# EasyEDA Pro project 01_立创eda专业版_esp32语音助手-自制版_2024-07-09.epro, schematic Schematic1

## Sheets
1 esp32_mini: Create Date: 2024-06-12; Page Name: esp32_mini; Project Name: esp32语音助手-自制版; Schematic Name: Schematic1; Update Date: 2024-06-21; Company: 嘉立创EDA; Page Size: A4; Version: V1.0
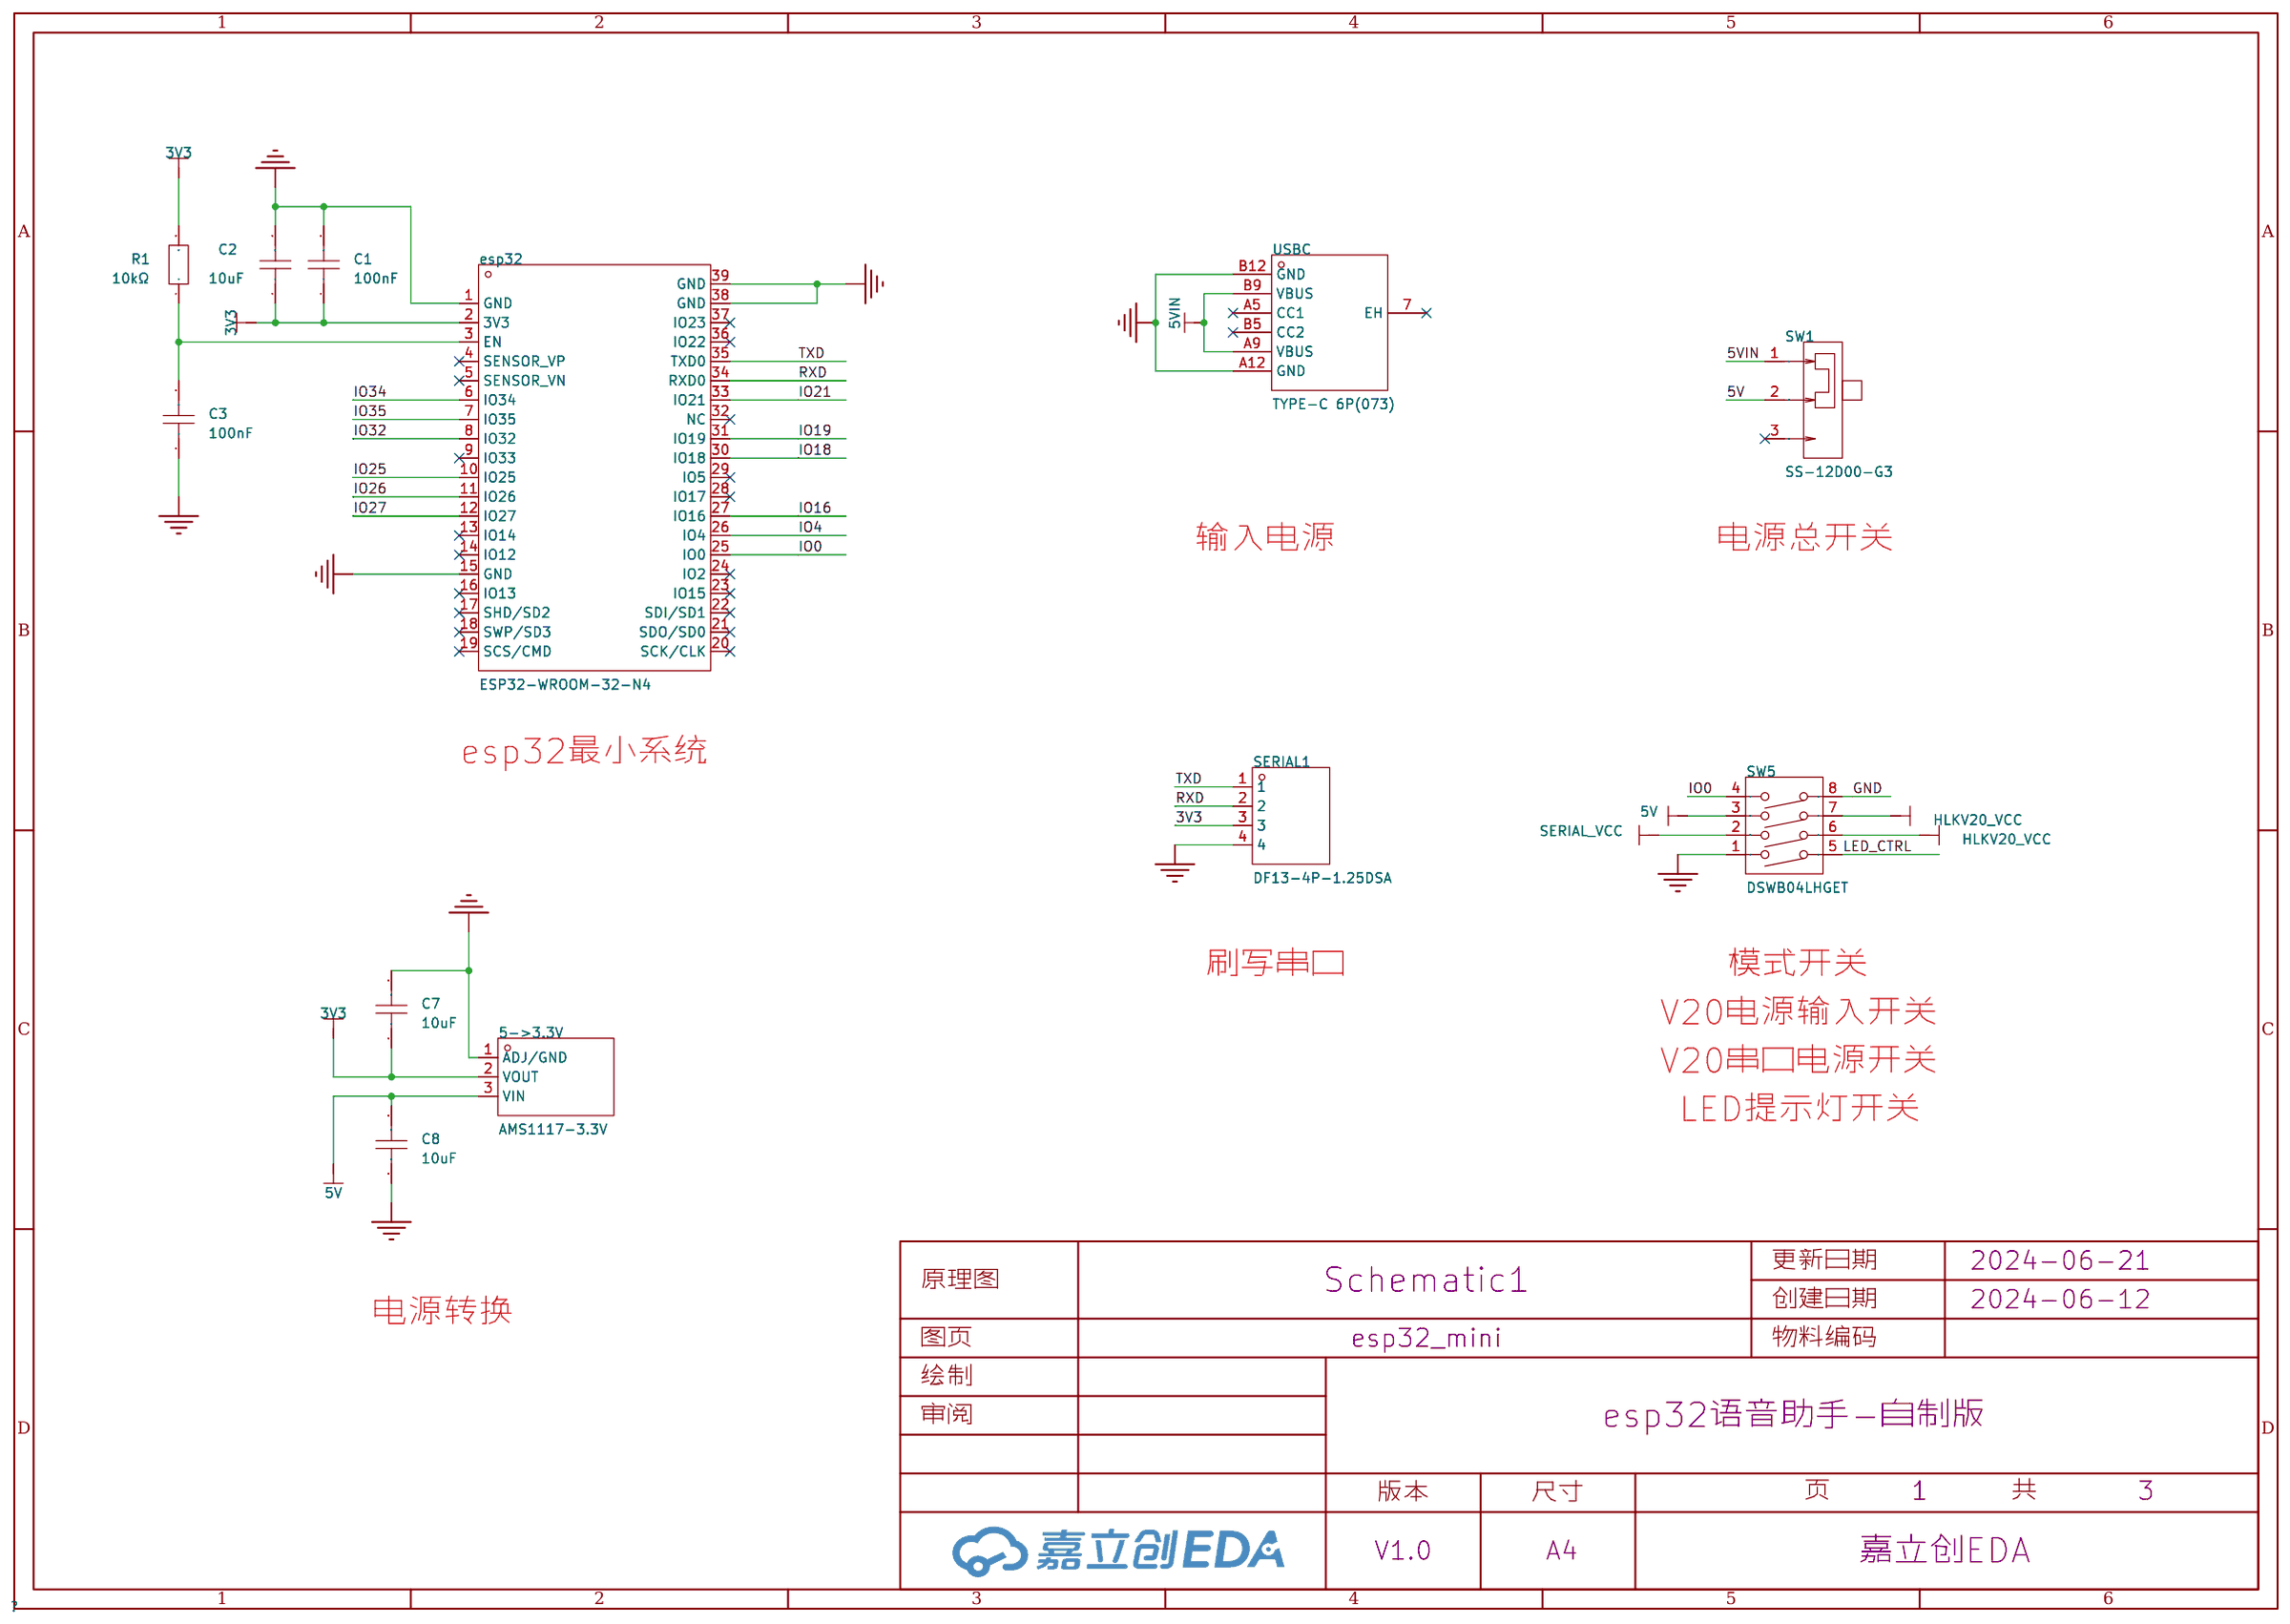
[diagram p0: esp32_mini]
2 hlkv20: Page Name: hlkv20; Update Date: 2024-06-16
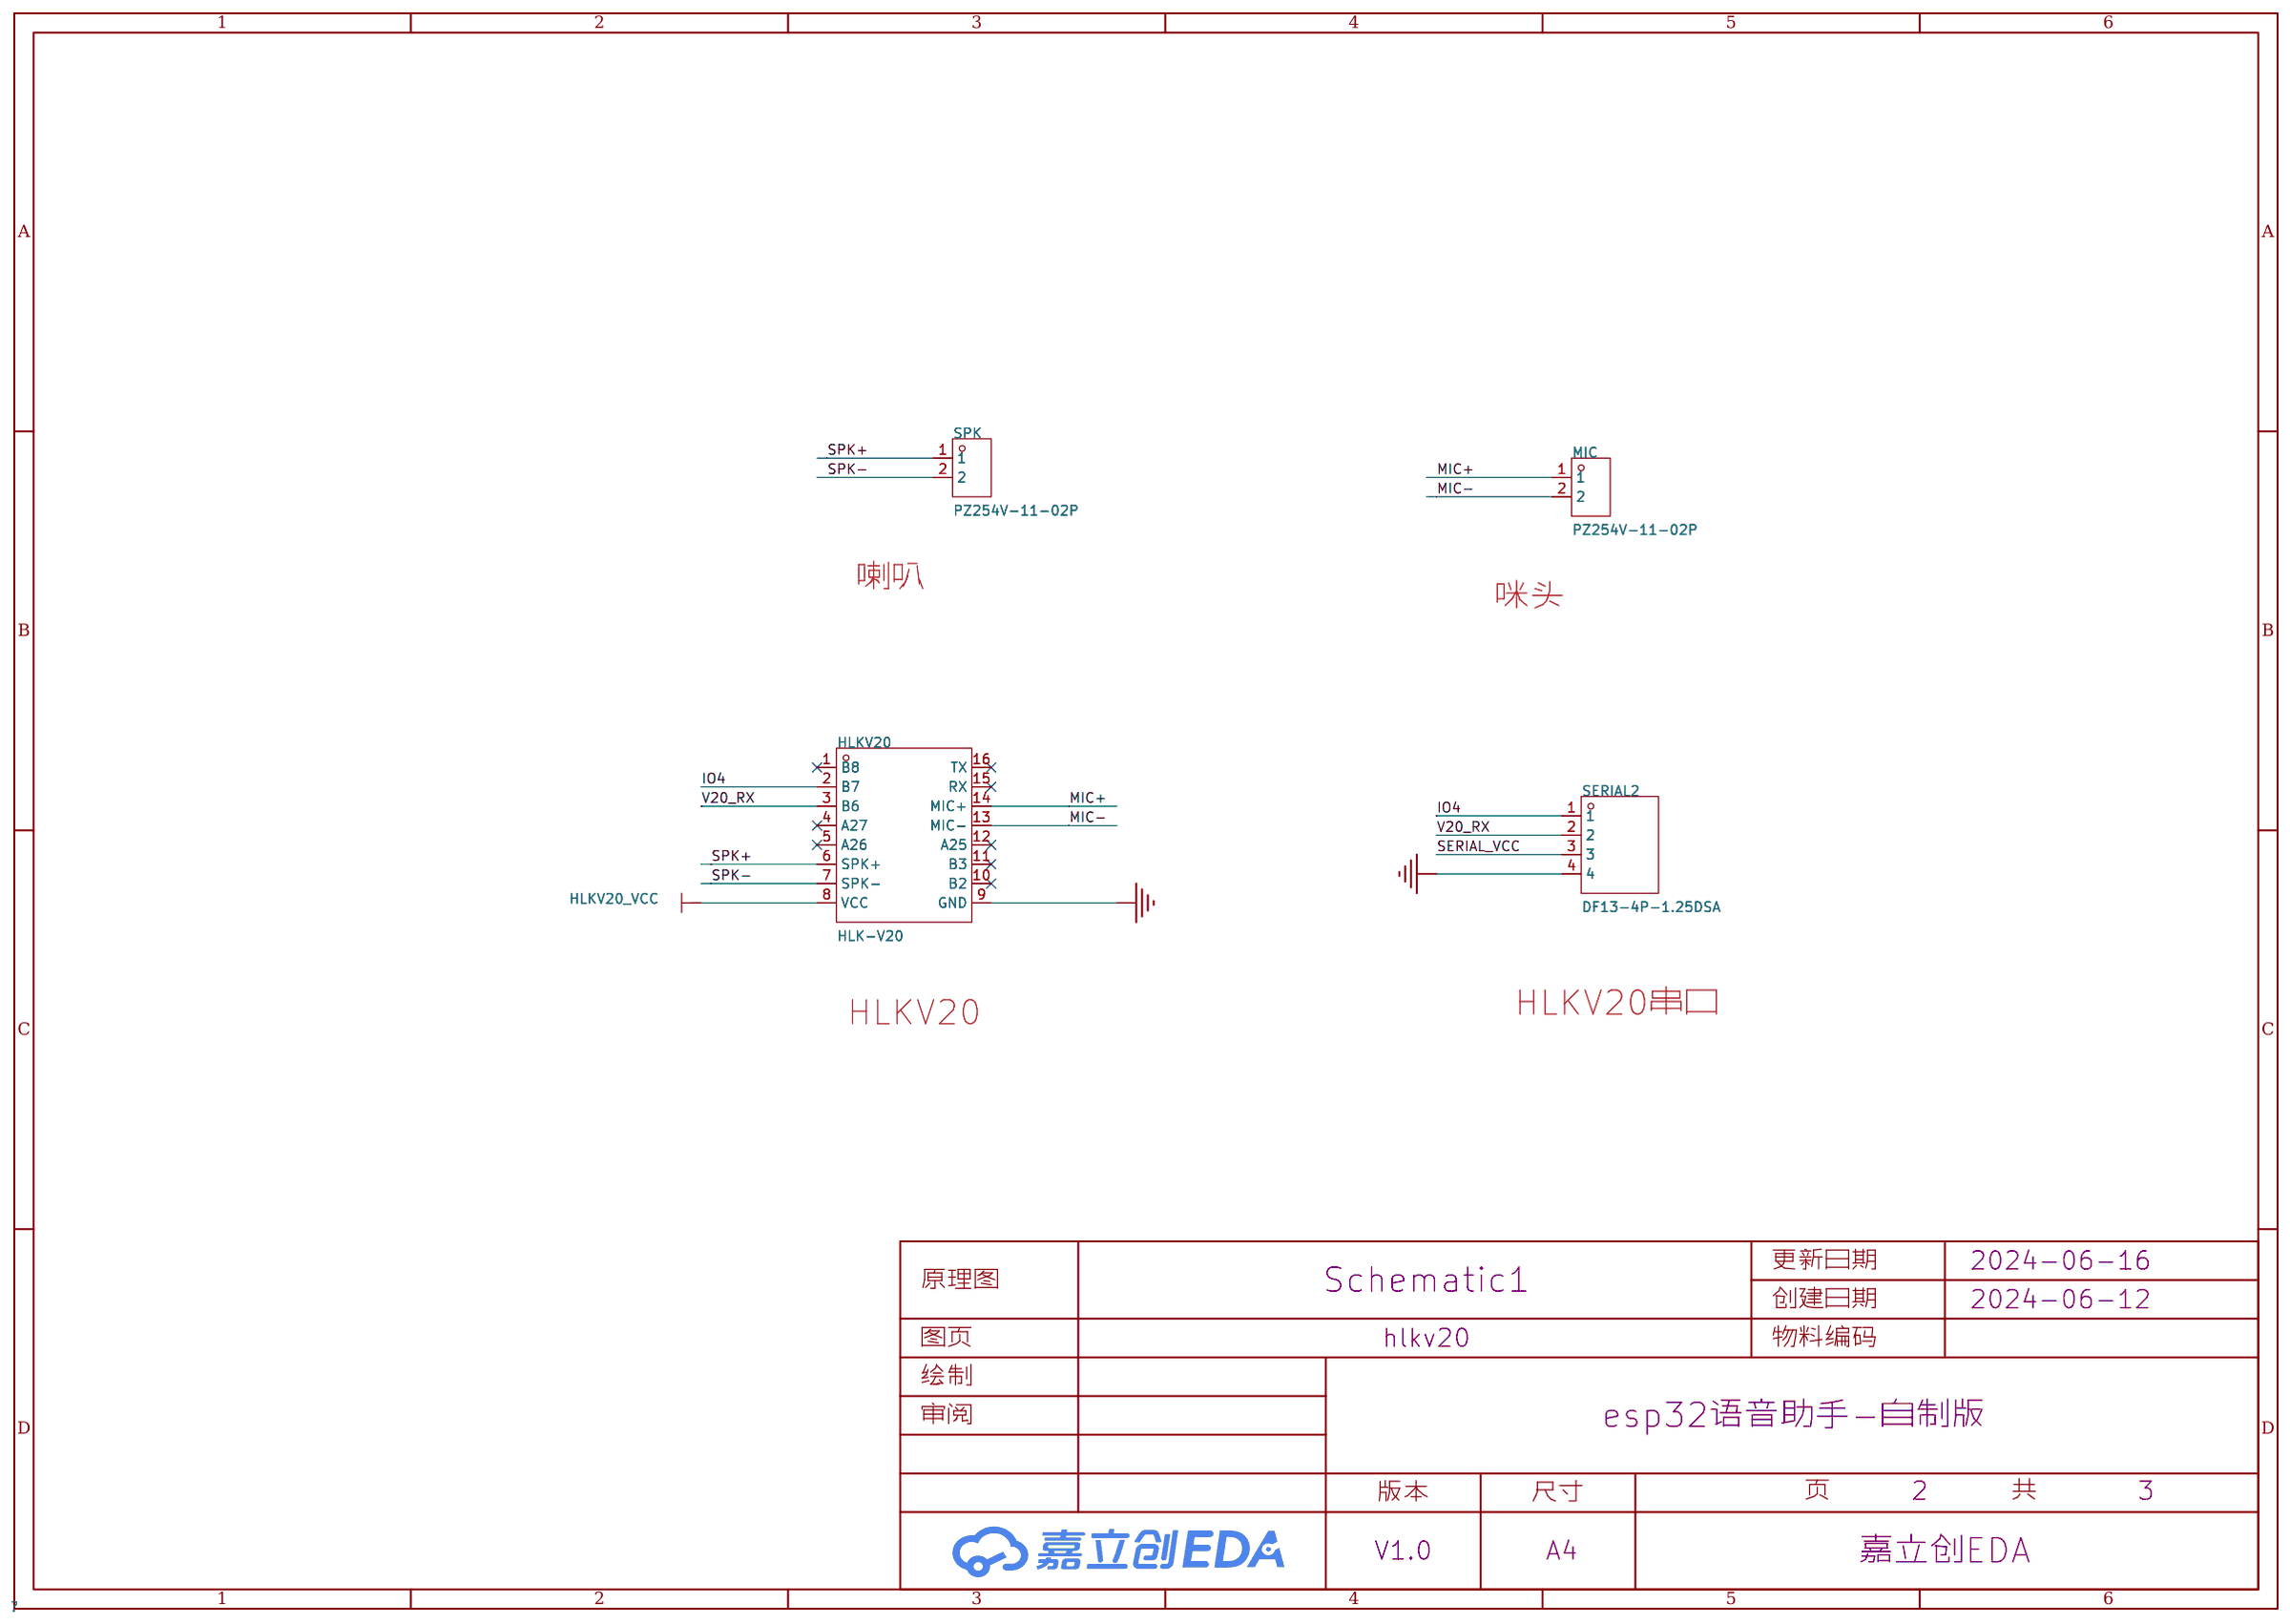
[diagram p1: hlkv20]
3 inandout: Page Name: inandout; Update Date: 2024-06-13
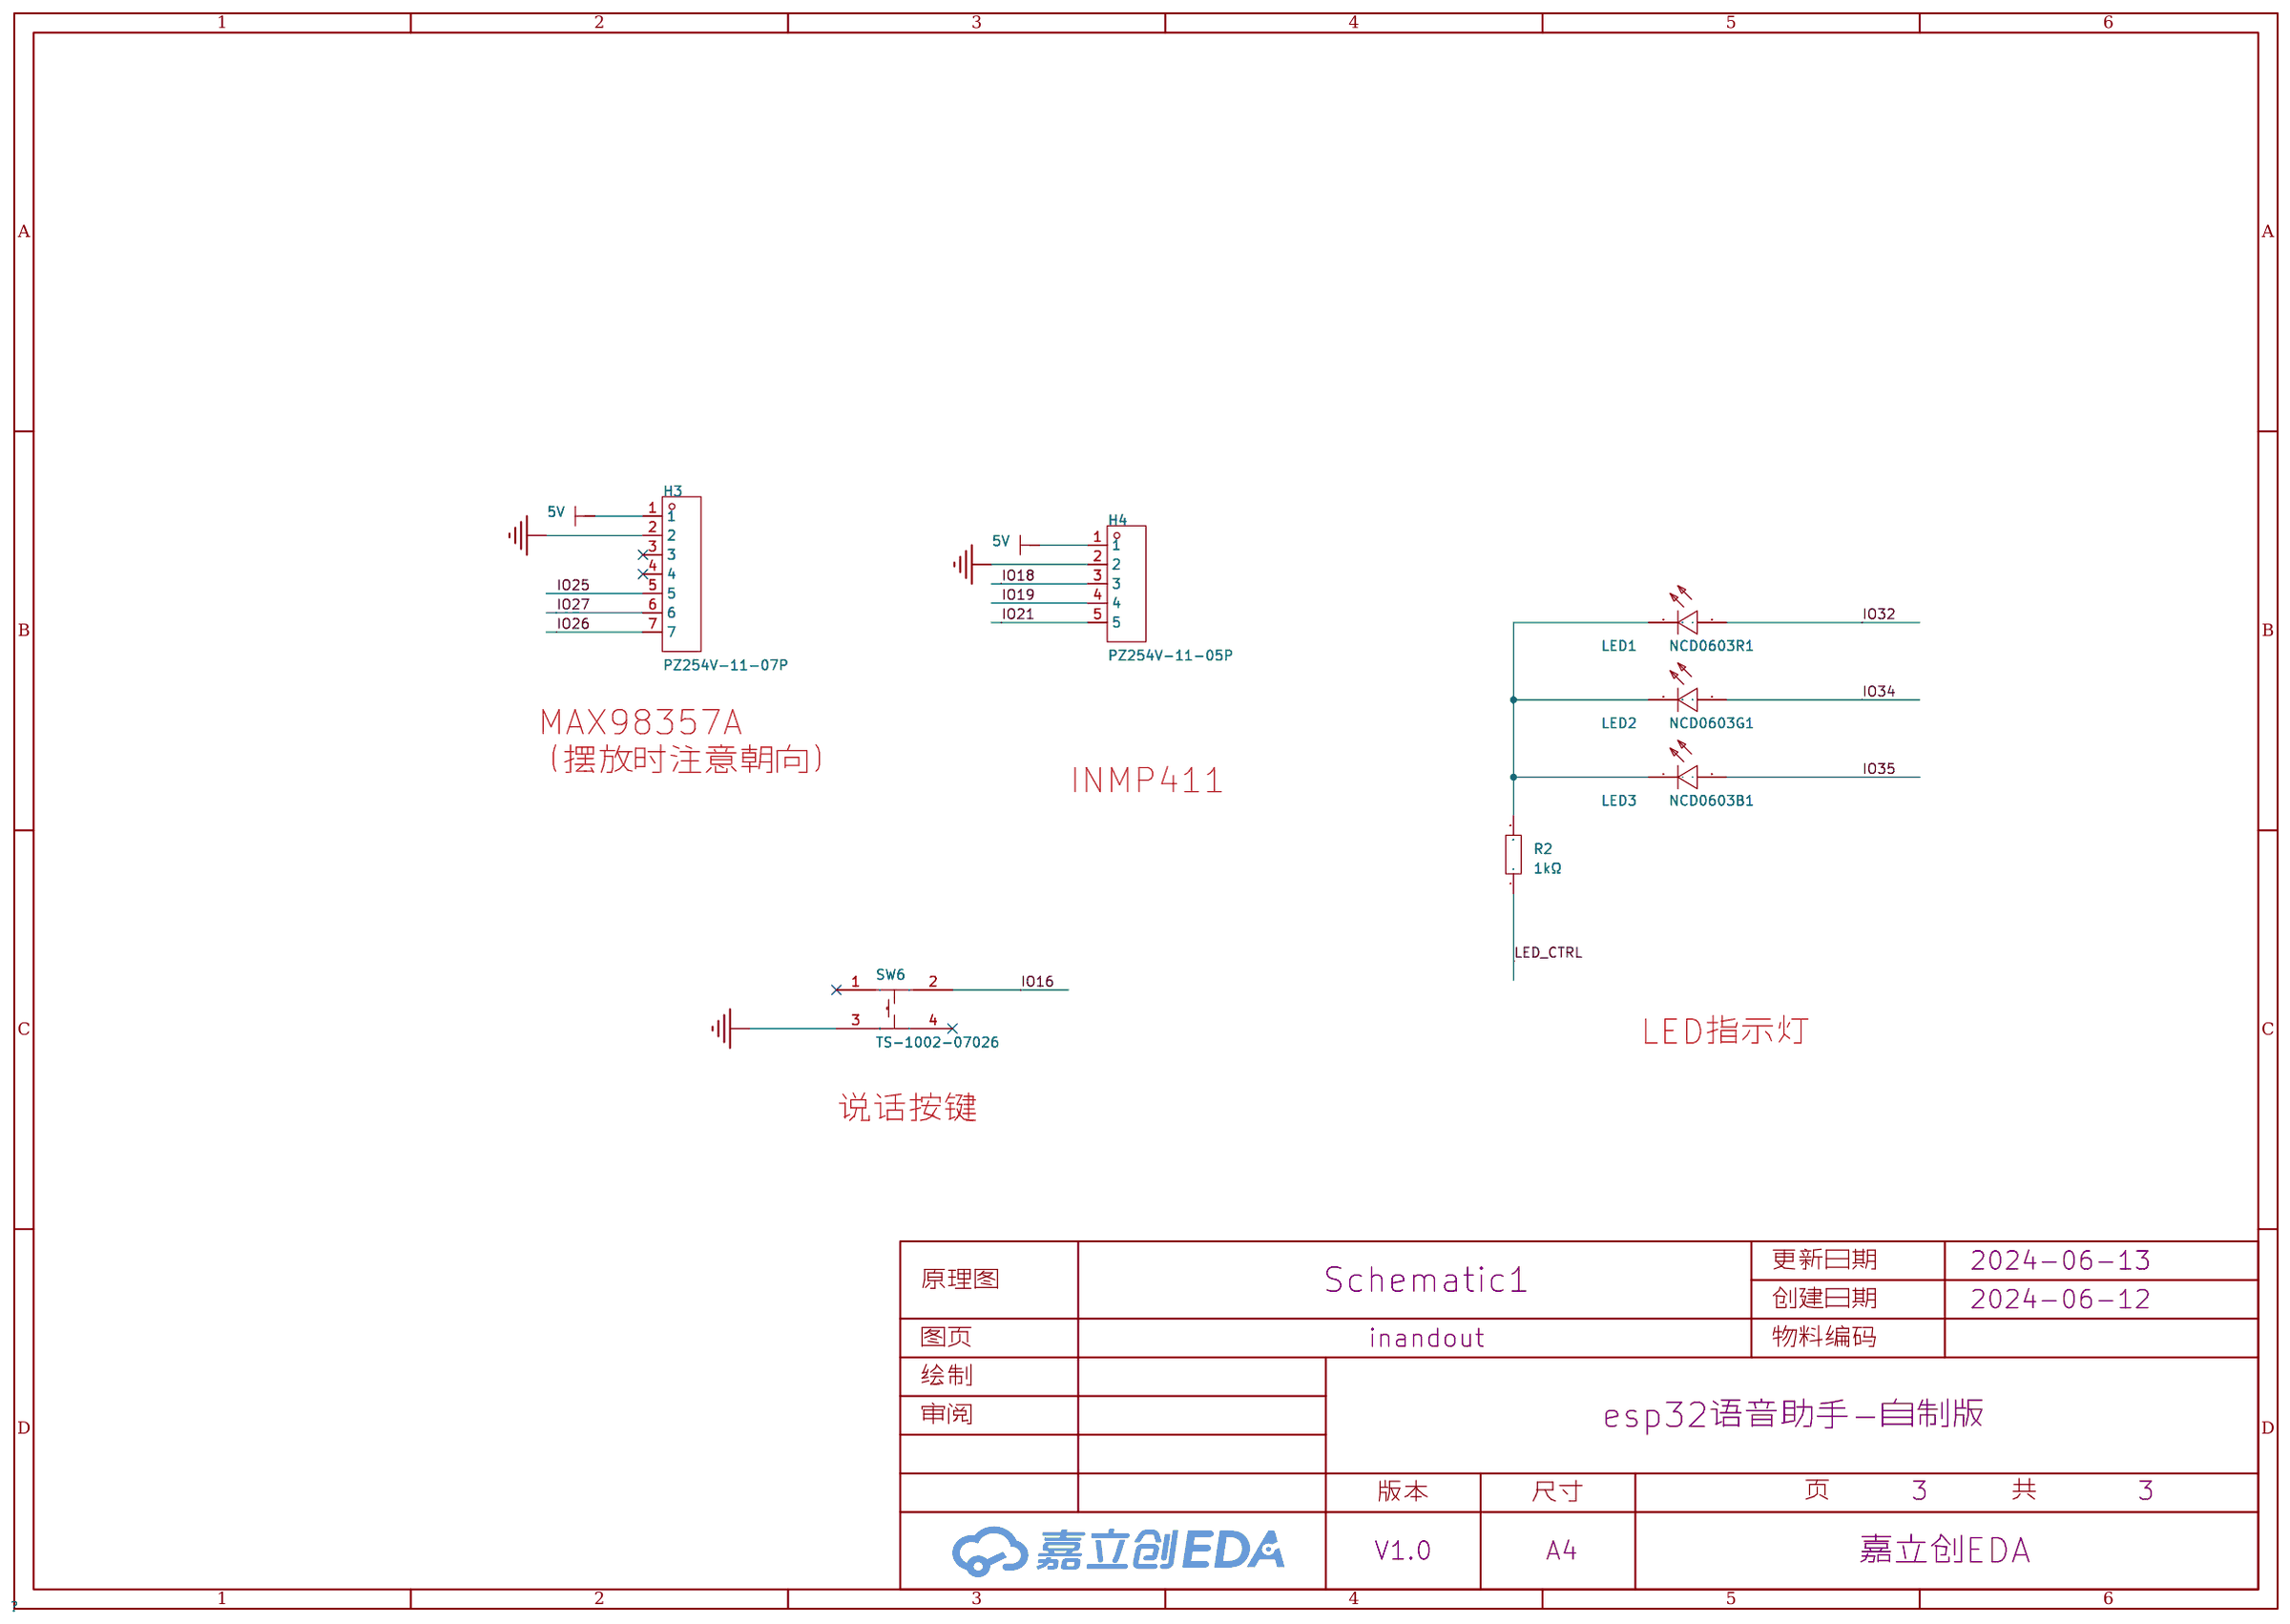
[diagram p2: inandout]

## Parts
sheet esp32_mini
5->3.3V  AMS1117-3.3V  [SOT-89-3_L4.5-W2.5-P1.50-LS4.2-BR]
C1  100nF  [C0603]
C2  10uF  [C0603]
C3  100nF  [C0603]
C7  10uF  [C0603]
C8  10uF  [C0603]
esp32  ESP32-WROOM-32-N4  [WIFIM-SMD_ESP32-WROOM-32-N4]
R1  10kΩ  [R0603]
SERIAL1  DF13-4P-1.25DSA  [CONN-TH_DF13-4P-1.25DSA]
SW1  SS-12D00-G3  [SW-TH_SS-12D00-G3]
SW5  DSWB04LHGET  [SW-TH_DSWB04LHGET]
USBC  TYPE-C 6P(073)  [TYPE-C-SMD_TYPE-C-6P]
sheet hlkv20
HLKV20  HLK-V20  [SMD-16_L18.0-W16.0-P2.00-HLK-V20]
MIC  PZ254V-11-02P  [HDR-TH_2P-P2.54-V-M]
SERIAL2  DF13-4P-1.25DSA  [CONN-TH_DF13-4P-1.25DSA]
SPK  PZ254V-11-02P  [HDR-TH_2P-P2.54-V-M]
sheet inandout
H3  PZ254V-11-07P  [HDR-TH_7P-P2.54-V-M]
H4  PZ254V-11-05P  [HDR-TH_5P-P2.54-V-M]
LED1  NCD0603R1  [LED0603-RD_RED]
LED2  NCD0603G1  [LED0603-RD]
LED3  NCD0603B1  [LED0603-RD]
R2  1kΩ  [R0603]
SW6  TS-1002-07026  [SW-TH_4P-L6.0-W6.0-P4.50-LS6.5]

## Library data of the parts
5->3.3V = AMS1117-3.3V_C5120796: 输出类型:固定;最大输入电压:18V;输出电压:3.3V;最大输出电流:1A;输出极性:正极;; LCSC Part Name: 输入18V 输出3.3V 1A; Supplier Part: C5120796; Manufacturer: MSKSEMI(美森科); Supplier Footprint: SOT-89; JLCPCB Part Class: 扩展库; Datasheet: https://atta.szlcsc.com/upload/public/pdf/source/20231123/6117526697EB8BF6175FDEEBA0877266.pdf; Supplier: LCSC; Output Type: 固定; Maximum Input Voltage: 18V; Output Voltage: 3.3V; MAX Output Current: 1A; Dropout Voltage: 1.4V@(1A); standby current: 12mA; Operating Temperature: 0℃~+125℃; Output Polarity: 正极; Number of Outputs: 1
C1 C3 = CC0603KRX7R9BB104: 容值:100nF;精度:±10%;额定电压:50V;材质(温度系数):X7R;; LCSC Part Name: 100nF ±10% 50V; Supplier Part: C14663; Manufacturer: YAGEO(国巨); Supplier Footprint: 0603; JLCPCB Part Class: 基础库; Datasheet: https://atta.szlcsc.com/upload/public/pdf/source/20180910/C282072_33301C7F631E79921B82A8DAC6BCC5B3.pdf; Supplier: LCSC; Tolerance: ±10%; Voltage Rated: 50V; Temperature Coefficient: X7R
C2 = CL10A106MA8NRNC: 容值:10uF;精度:±20%;额定电压:25V;材质(温度系数):X5R;; LCSC Part Name: 10uF ±20% 25V; Supplier Part: C96446; Manufacturer: SAMSUNG(三星); Supplier Footprint: 0603; JLCPCB Part Class: 基础库; Datasheet: https://atta.szlcsc.com/upload/public/pdf/source/20160218/1457707763339.pdf; Supplier: LCSC; Tolerance: ±20%; Voltage Rated: 25V; Temperature Coefficient: X5R
C7 C8 = CL10A106KP8NNNC: 容值:10uF;精度:±10%;额定电压:10V;材质(温度系数):X5R;; LCSC Part Name: 10uF ±10% 10V; Supplier Part: C19702; Manufacturer: SAMSUNG(三星); Supplier Footprint: 0603; JLCPCB Part Class: 基础库; Datasheet: https://atta.szlcsc.com/upload/public/pdf/source/20160218/1457707763339.pdf; Supplier: LCSC; Tolerance: ±10%; Voltage Rated: 10V; Temperature Coefficient: X5R
esp32 = ESP32-WROOM-32-N4: WiFi+蓝牙4.2+双核CPU,ESP32; LCSC Part Name: WiFi+蓝牙4.2+双核CPU模块; Supplier Part: C82899; Manufacturer: ESPRESSIF(乐鑫); Supplier Footprint: SMD,18x25.5mm; JLCPCB Part Class: 扩展库; Datasheet: https://atta.szlcsc.com/upload/public/pdf/source/20210719/C82899_2D52724B6FAFABC419BCF308C5944296.pdf; Supplier: LCSC
R1 = FRC0603J103TS: 电阻类型:厚膜电阻;阻值:10kΩ;精度:±5%;功率:100mW;最大工作电压:75V;温度系数:±100ppm/℃;; LCSC Part Name: 10kΩ ±5% 100mW 厚膜电阻; Supplier Part: C2930027; Manufacturer: FOJAN(富捷); Supplier Footprint: 0603; JLCPCB Part Class: 扩展库; Datasheet: https://atta.szlcsc.com/upload/public/pdf/source/20211221/925EC7D7225764EE0046F22065062C87.pdf; Supplier: LCSC; Type: 厚膜电阻; Tolerance: ±5%; Power(Watts): 100mW; Overload Voltage (Max): 75V; Temperature Coefficient: ±100ppm/℃; Operating Temperature Range: -55℃~+155℃
SERIAL1 SERIAL2 = DF13-4P-1.25DSA: 插针结构:1x4P;间距:1.25mm;安装方式:-;参考系列:-;总PIN数:4P;排数:1;每排PIN数:4;行距:-;触头材质:黄铜;; LCSC Part Name: 间距:1.25mm 1x4P; Supplier Part: C202091; Manufacturer: HRS(广濑); Supplier Footprint: P=1.25mm; JLCPCB Part Class: 扩展库; Datasheet: https://atta.szlcsc.com/upload/public/pdf/source/20180509/C202091_DB48A71B72F23293CB2FD82E8A62B156.pdf; Supplier: LCSC; Pins Structure: 1x4P; Pitch: 1.25mm; Number of Pins: 4P; Number of Rows: 1; Number of PINs Per Row: 4; Contact Material: 黄铜
SW1 = SS-12D00-G3: Supplier Part: C22355741; Manufacturer: SOFNG(硕方); Supplier Footprint: 插件-3P,8.8x3.9mm; Datasheet: https://atta.szlcsc.com/upload/public/pdf/source/20240529/1037A069FE9BBCECE56007AB916D4384.pdf; Supplier: LCSC
SW5 = DSWB04LHGET: 类型:平拨,凸起式;电路结构:单刀单掷;开关位数:4位;使用寿命:-;颜色:红色;; LCSC Part Name: 间距2.54mm 平拨,凸起式 4位拨码开关; Supplier Part: C99418; Manufacturer: YE; Supplier Footprint: 插件; JLCPCB Part Class: 扩展库; Datasheet: https://atta.szlcsc.com/upload/public/pdf/source/20220830/02827E67A8727938D957A3CE4C86C92D.pdf; Supplier: LCSC; Type: 平拨,凸起式; Circuit: 单刀单掷; Number of Positions: 4位; Lead Pitch: 2.54mm; Color: 红色
USBC = TYPE-C 6P(073): 连接器类型:Type-C;标准:-;公母:母;端口数量:1;触点数量:6P;安装方式:卧贴;额定电流 - 电源:5A;工作温度范围:-25℃~+85℃;; LCSC Part Name: Type-C 母 卧贴; Supplier Part: C668623; Manufacturer: SHOU HAN(首韩); Supplier Footprint: SMD; JLCPCB Part Class: 扩展库; Datasheet: https://atta.szlcsc.com/upload/public/pdf/source/20200618/C668623_A4B260DED7AC1949BAC6AE39E9F4CD80.pdf; Supplier: LCSC; Connector Type: Type-C; Gender: 母; Number of Ports: 1; Number of Contacts: 6P; Mounting Style: 卧贴; Current Rating - Power (Max): 5A; Operating Temperature Range: -25℃~+85℃
HLKV20 = HLK-V20: Supplier Part: C2831623; Manufacturer: HI-LINK(海凌科); JLCPCB Part Class: 扩展库; Datasheet: https://atta.szlcsc.com/upload/public/pdf/source/20210630/C2831623_FC9FEB51768199029C6D7EE3A64B85DD.pdf; Supplier: LCSC
MIC SPK = PZ254V-11-02P: 插针结构:1x2P;间距:2.54mm;行距:-;圆针/方针:方针;安装类型:直插;排数:单排;总PIN位数:2P;额定电流:-;额定电压:-;配合针长度:6mm;塑高:2.5mm;端接针长度:3mm;触头材质:黄铜;触头镀层:-;工作温度范围:-40℃~+105℃;颜色:黑色;; LCSC Part Name: 间距:2.54mm 1x2P 直插 方针; Supplier Part: C492401; Manufacturer: XFCN(兴飞); Supplier Footprint: 插件,P=2.54mm; JLCPCB Part Class: 扩展库; Datasheet: https://atta.szlcsc.com/upload/public/pdf/source/20200309/C492401_A812433581A9B211A7FFA413ADDFF0E5.pdf; Supplier: LCSC; Pin Structure: 1x2P; Pitch: 2.54mm; Circluar Pins/Square Pins: 方针; Mounting Type: 直插; Number of Rows: 单排; Number of Pins: 2P; Length of Mating Pin: 6mm; Insulation Height: 2.5mm; Length of End Connection Pin: 3mm; Contact Material: 黄铜; Operating Temperature Range: -40℃~+105℃; Color: 黑色
H3 = PZ254V-11-07P: 插针结构:1x7P;间距:2.54mm;行距:-;圆针/方针:方针;安装类型:直插;排数:单排;总PIN位数:7P;额定电流:-;额定电压:-;配合针长度:6mm;塑高:2.5mm;端接针长度:3mm;触头材质:黄铜;触头镀层:-;工作温度范围:-40℃~+105℃;颜色:黑色;; LCSC Part Name: 间距:2.54mm 1x7P 直插 方针; Supplier Part: C492406; Manufacturer: XFCN(兴飞); Supplier Footprint: 插件,P=2.54mm; JLCPCB Part Class: 扩展库; Datasheet: https://atta.szlcsc.com/upload/public/pdf/source/20200309/C492406_654C533EE691117E22DD9F76C114C2D9.pdf; Supplier: LCSC; Pin Structure: 1x7P; Pitch: 2.54mm; Circluar Pins/Square Pins: 方针; Mounting Type: 直插; Number of Rows: 单排; Number of Pins: 7P; Length of Mating Pin: 6mm; Insulation Height: 2.5mm; Length of End Connection Pin: 3mm; Contact Material: 黄铜; Operating Temperature Range: -40℃~+105℃; Color: 黑色
H4 = PZ254V-11-05P: 插针结构:1x5P;间距:2.54mm;行距:-;圆针/方针:方针;安装类型:直插;排数:单排;总PIN位数:5P;额定电流:-;额定电压:-;配合针长度:6mm;塑高:2.5mm;端接针长度:3mm;触头材质:黄铜;触头镀层:-;工作温度范围:-40℃~+105℃;颜色:黑色;; LCSC Part Name: 间距:2.54mm 1x5P 直插 方针; Supplier Part: C492404; Manufacturer: XFCN(兴飞); Supplier Footprint: 插件,P=2.54mm; JLCPCB Part Class: 扩展库; Datasheet: https://atta.szlcsc.com/upload/public/pdf/source/20200309/C492404_E51533260F8710EFF5D4617281164C1D.pdf; Supplier: LCSC; Pin Structure: 1x5P; Pitch: 2.54mm; Circluar Pins/Square Pins: 方针; Mounting Type: 直插; Number of Rows: 单排; Number of Pins: 5P; Length of Mating Pin: 6mm; Insulation Height: 2.5mm; Length of End Connection Pin: 3mm; Contact Material: 黄铜; Operating Temperature Range: -40℃~+105℃; Color: 黑色
LED1 = NCD0603R1_C84263: 灯头类型:-;发光颜色:红色;正向电压(VF):1.6V~2.6V;功率:65mW;正向电流:20mA;主波长:615nm~630nm;二极管配置:独立二极管;透镜颜色:无色透明透镜;色温:-;发光强度:80mcd~220mcd;发光角度:130°;载带方式:-;工作温度:-30℃~+85℃;; Supplier Part: C84263; Manufacturer: 国星光电; Supplier Footprint: 0603; JLCPCB Part Class: 扩展库; Datasheet: https://atta.szlcsc.com/upload/public/pdf/source/20200820/C84263_DABC6A75E58F576973B407FDBA283D60.pdf; Supplier: LCSC; Emitted Color: 红色; Forward Voltage (VF): 1.6V~2.6V; Power Dissipation: 65mW; Forward Current: 20mA; Dominant Wavelength: 615nm~630nm; Diode Configuration: 独立二极管; Lens Color: 无色透明透镜; Luminous Intensity: 80mcd~220mcd; Viewing Angle: 130°; Operating Temperature: -30℃~+85℃
LED2 = NCD0603G1: 发光颜色:翠绿色;正向电压(VF):2.6V~3.6V;功率:72mW;正向电流:10mA;主波长:515nm~530nm;透镜颜色:无色透明透镜;发光强度:330mcd~900mcd;发光角度:130°;工作温度:-30℃~+85℃;; Supplier Part: C84267; Manufacturer: 国星光电; Supplier Footprint: 0603; JLCPCB Part Class: 扩展库; Datasheet: https://atta.szlcsc.com/upload/public/pdf/source/20200820/C84267_04BA7703640BAC111D09F5EFB971FBF3.pdf; Supplier: LCSC; Emitted Color: 翠绿色; Forward Voltage (VF): 2.6V~3.6V; Power Dissipation: 72mW; Forward Current: 10mA; Dominant Wavelength: 515nm~530nm; Lens Color: 无色透明透镜; Luminous Intensity: 330mcd~900mcd; Viewing Angle: 130°; Operating Temperature: -30℃~+85℃
LED3 = NCD0603B1: 发光颜色:蓝色;正向电压(VF):2.6V~3.6V;功率:72mW;正向电流:10mA;主波长:463nm~475nm;透镜颜色:无色透明透镜;发光强度:80mcd~220mcd;发光角度:130°;工作温度:-30℃~+85℃;; Supplier Part: C84266; Manufacturer: 国星光电; Supplier Footprint: 0603; JLCPCB Part Class: 扩展库; Datasheet: https://atta.szlcsc.com/upload/public/pdf/source/20200820/C84266_6A3CDBEFA72C6CAD68EDA53474ADAE6C.pdf; Supplier: LCSC; Emitted Color: 蓝色; Forward Voltage (VF): 2.6V~3.6V; Power Dissipation: 72mW; Forward Current: 10mA; Dominant Wavelength: 463nm~475nm; Lens Color: 无色透明透镜; Luminous Intensity: 80mcd~220mcd; Viewing Angle: 130°; Operating Temperature: -30℃~+85℃
R2 = RC0603FR-071KL: 电阻类型:厚膜电阻;阻值:1kΩ;精度:±1%;功率:100mW;最大工作电压:75V;温度系数:±100ppm/℃;; LCSC Part Name: 厚膜电阻 1kΩ ±1% 100mW; Supplier Part: C22548; Manufacturer: YAGEO(国巨); Supplier Footprint: 0603; JLCPCB Part Class: 扩展库; Datasheet: https://atta.szlcsc.com/upload/public/pdf/source/20180316/70C0E2BDAE7FCC62C531A5A58D202EE1.pdf; Supplier: LCSC; Type: 厚膜电阻; Tolerance: ±1%; Power(Watts): 100mW; Overload Voltage (Max): 75V; Temperature Coefficient: ±100ppm/℃; Operating Temperature Range: -55℃~+155℃
SW6 = TS-1002-07026: 电路结构:单刀单掷;按钮形状:圆形按钮;安装方式:直插;开关长度:6mm;开关宽度:6mm;开关高度:7mm;触点电流:50mA;额定电压(DC):12V;带灯:-;机械寿命:-;; LCSC Part Name: 6*6*7mm 直插 轻触开关; Supplier Part: C455095; Manufacturer: XUNPU(讯普); Supplier Footprint: 插件,6x6mm; JLCPCB Part Class: 扩展库; Datasheet: https://atta.szlcsc.com/upload/public/pdf/source/20231108/52BC6409AB52B6746CCC051A15664904.pdf; Supplier: LCSC; Circuit: 单刀单掷; Actuator Style: 圆形按钮; Mounting Style: 直插; Switch Length: 6mm; Switch Width: 6mm; Switch Height: 7mm; Contact Current: 50mA; Voltage Rating (DC): 12V

## Nets
3V3: 5->3.3V.2(VOUT) C1.1 C2.1 C7.1 esp32.2(3V3) R1.2 SERIAL1.3
5V: 5->3.3V.3(VIN) C8.2 H3.1 H4.1 SW1.2 SW5.3
5VIN: SW1.1 USBC.A9(VBUS) USBC.B9(VBUS)
GND: 5->3.3V.1(ADJ/GND) C1.2 C2.2 C3.1 C7.2 C8.1 esp32.1(GND) esp32.15(GND) esp32.38(GND) esp32.39(GND) H3.2 H4.2 HLKV20.9(GND) SERIAL1.4 SERIAL2.4 SW5.1 SW5.8 SW6.3 USBC.A12(GND) USBC.B12(GND)
V20_RX: HLKV20.3(B6) SERIAL2.2
HLKV20_VCC: HLKV20.8(VCC) SW5.6 SW5.7
IO0: esp32.25(IO0) SW5.4
IO4: esp32.26(IO4) HLKV20.2(B7) SERIAL2.1
IO16: esp32.27(IO16) SW6.2
IO18: esp32.30(IO18) H4.3
IO19: esp32.31(IO19) H4.4
IO21: esp32.33(IO21) H4.5
IO25: esp32.10(IO25) H3.5
IO26: esp32.11(IO26) H3.7
IO27: esp32.12(IO27) H3.6
IO32: esp32.8(IO32) LED1.2(A)
IO34: esp32.6(IO34) LED2.2(A)
IO35: esp32.7(IO35) LED3.2(+)
LED_CTRL: R2.1 SW5.5
MIC+: HLKV20.14(MIC+) MIC.1
MIC-: HLKV20.13(MIC-) MIC.2
RXD: esp32.34(RXD0) SERIAL1.2
SERIAL_VCC: SERIAL2.3 SW5.2
SPK+: HLKV20.6(SPK+) SPK.1
SPK-: HLKV20.7(SPK-) SPK.2
TXD: esp32.35(TXD0) SERIAL1.1
$1N784: C3.2 esp32.3(EN) R1.1
$3N1069: LED1.1(K) LED2.1(K) LED3.1(-) R2.2

Not connected (* = marked no-connect by the designer): esp32 4(SENSOR_VP)* 5(SENSOR_VN)* 9(IO33)* 13(IO14)* 14(IO12)* 16(IO13)* 17(SHD/SD2)* 18(SWP/SD3)* 19(SCS/CMD)* 20(SCK/CLK)* 21(SDO/SD0)* 22(SDI/SD1)* 23(IO15)* 24(IO2)* 28(IO17)* 29(IO5)* 32(NC)* 36(IO22)* 37(IO23)*; H3 3* 4*; HLKV20 1(B8)* 4(A27)* 5(A26)* 10(B2)* 11(B3)* 12(A25)* 15(RX)* 16(TX)*; SW1 3*; SW6 1* 4*; USBC 7(EH)* A5(CC1)* B5(CC2)*

## Notes on the sheets
sheet 1
- 输入电源
- 电源总开关
- esp32最小系统
- 刷写串口
- 模式开关
- V20电源输入开关
- V20串口电源开关
- LED提示灯开关
- 电源转换
sheet 2
- 喇叭
- 咪头
- HLKV20
- HLKV20串口
sheet 3
- MAX98357A
  （摆放时注意朝向）
- INMP411
- LED指示灯
- 说话按键
